# EAGLE design pololu-steppers-power-side (EAGLE 5.06)
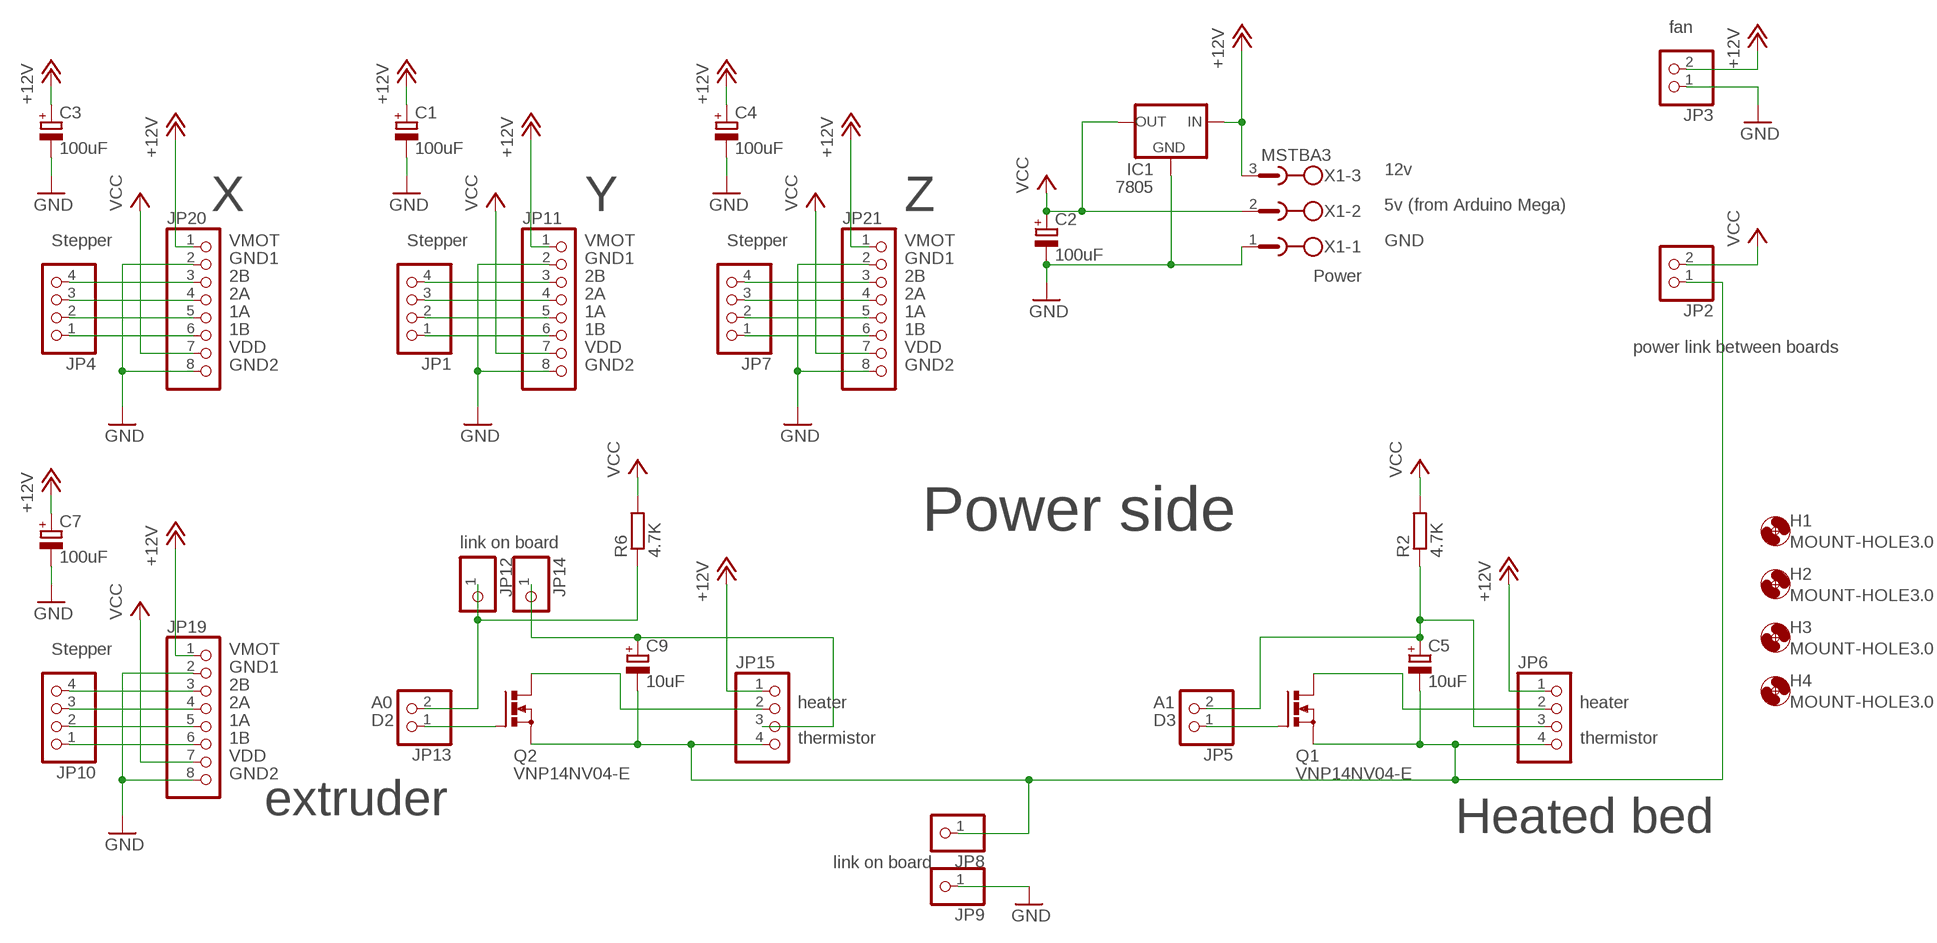
[diagram p0: schematic, sheet 1]

## Parts
C1  100uF  CPOL-EUE3.5-10  [E3,5-10]
C2  100uF  CPOL-EUE3.5-10  [E3,5-10]
C3  100uF  CPOL-EUE3.5-10  [E3,5-10]
C4  100uF  CPOL-EUE3.5-10  [E3,5-10]
C5  10uF  CPOL-EUE5-5  [E5-5]
C7  100uF  CPOL-EUE3.5-10  [E3,5-10]
C9  10uF  CPOL-EUE5-5  [E5-5]
H1  MOUNT-HOLE3.0  [3,0]
H2  MOUNT-HOLE3.0  [3,0]
H3  MOUNT-HOLE3.0  [3,0]
H4  MOUNT-HOLE3.0  [3,0]
IC1  7805  78XXS  [78XXS]
JP1  PINHD-1X4  [1X04]
JP2  PINHD-1X2  [1X02]
JP3  PINHD-1X2  [1X02]
JP4  PINHD-1X4  [1X04]
JP5  PINHD-1X2  [1X02]
JP6  PINHD-1X4  [1X04]
JP7  PINHD-1X4  [1X04]
JP8  PINHD-1X1  [1X01]
JP9  PINHD-1X1  [1X01]
JP10  PINHD-1X4  [1X04]
JP11  PINHD-1X8  [1X08]
JP12  PINHD-1X1  [1X01]
JP13  PINHD-1X2  [1X02]
JP14  PINHD-1X1  [1X01]
JP15  PINHD-1X4  [1X04]
JP19  PINHD-1X8  [1X08]
JP20  PINHD-1X8  [1X08]
JP21  PINHD-1X8  [1X08]
Q1  VNP14NV04-E  BUZ11BV  [TO220BV]
Q2  VNP14NV04-E  BUZ11BV  [TO220BV]
R2  4.7K  R-EU_0207/7  [0207/7]
R6  4.7K  R-EU_0207/7  [0207/7]
X1  MSTBA3  [MSTBA3]

## Nets
+12V: C1.+ C3.+ C4.+ C7.+ IC1.IN JP3.2 JP6.1 JP11.1 JP15.1 JP19.1 JP20.1 JP21.1 X1.3
GND: C1.- C2.- C3.- C4.- C7.- IC1.GND JP3.1 JP9.1 JP11.2 JP11.8 JP19.2 JP19.8 JP20.2 JP20.8 JP21.2 JP21.8 X1.1
N$1: JP6.2 Q1.D
N$2: JP12.1 JP13.2 R6.1
N$3: JP5.1 Q1.G
N$4: JP4.4 JP20.3
N$5: JP4.3 JP20.4
N$6: C5.+ JP5.2 JP6.3 R2.1
N$8: JP1.4 JP11.3
N$9: JP1.3 JP11.4
N$10: JP1.2 JP11.5
N$11: JP1.1 JP11.6
N$12: JP4.2 JP20.5
N$13: JP4.1 JP20.6
N$14: C5.- C9.- JP2.1 JP6.4 JP8.1 JP15.4 Q1.S Q2.S
N$23: JP7.4 JP21.3
N$24: JP7.3 JP21.4
N$25: JP7.2 JP21.5
N$26: JP7.1 JP21.6
N$33: JP10.4 JP19.3
N$34: JP10.3 JP19.4
N$35: JP10.2 JP19.5
N$36: JP10.1 JP19.6
N$41: JP13.1 Q2.G
N$42: JP15.2 Q2.D
N$44: C9.+ JP14.1 JP15.3
VCC: C2.+ IC1.OUT JP2.2 JP11.7 JP19.7 JP20.7 JP21.7 R2.2 R6.2 X1.2

## Notes on the sheet
- fan
- 12v
- X | Y | Z | 5v (from Arduino Mega)
- Stepper | VMOT | Stepper | VMOT | Stepper | VMOT | GND
- GND1 | GND1 | GND1
- 2B | 2B | 2B | Power
- 2A | 2A | 2A
- 1A | 1A | 1A
- 1B | 1B | 1B
- VDD | VDD | VDD | power link between boards
- GND2 | GND2 | GND2
- Power side
- link on board
- Stepper | VMOT
- GND1
- 2B
- 2A | A0 | heater | A1 | heater
- 1A | D2 | D3
- 1B | thermistor | thermistor
- VDD
- GND2
- extruder
- Heated bed
- link on board

## Library data of the parts
C1-C5 C7 C9 = rcl:CPOL-EU: POLARIZED CAPACITOR, European symbol
H1-H4 = holes:MOUNT-HOLE: MOUNTING HOLE with drill center marker
IC1 = v-reg:78XXS: VOLTAGE REGULATOR
JP1 JP4 JP6 JP7 JP10 JP15 = pinhead:PINHD-1X4: PIN HEADER
JP2 JP3 JP5 JP13 = pinhead:PINHD-1X2: PIN HEADER
JP8 JP9 JP12 JP14 = pinhead:PINHD-1X1: PIN HEADER
JP11 JP19-JP21 = pinhead:PINHD-1X8: PIN HEADER
Q1 Q2 = transistor-power:BUZ11: N-CHANNEL MOS FET
R2 R6 = rcl:R-EU_: RESISTOR, European symbol
X1 = con-phoenix-508:MSTBA3: PHOENIX

## Board
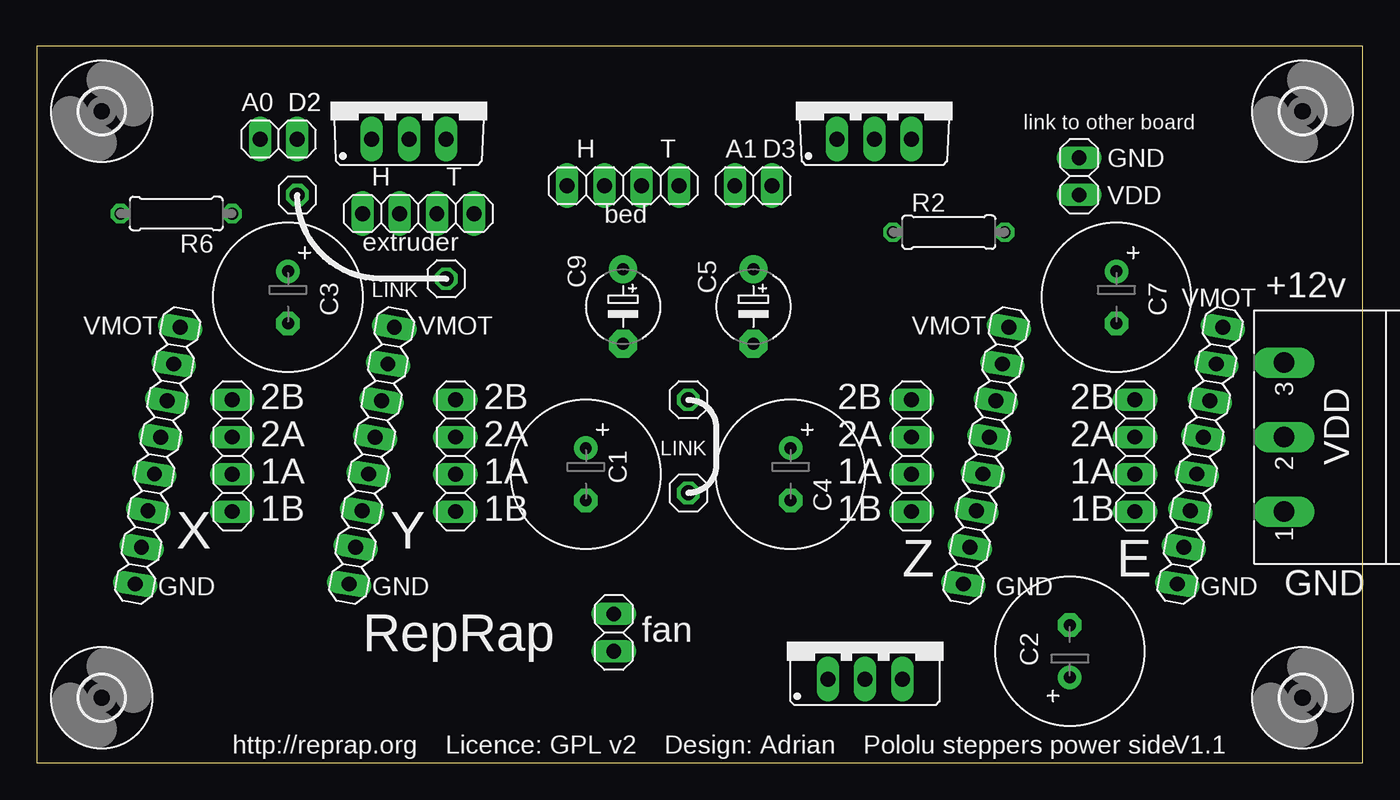
[diagram p1: board, top side]
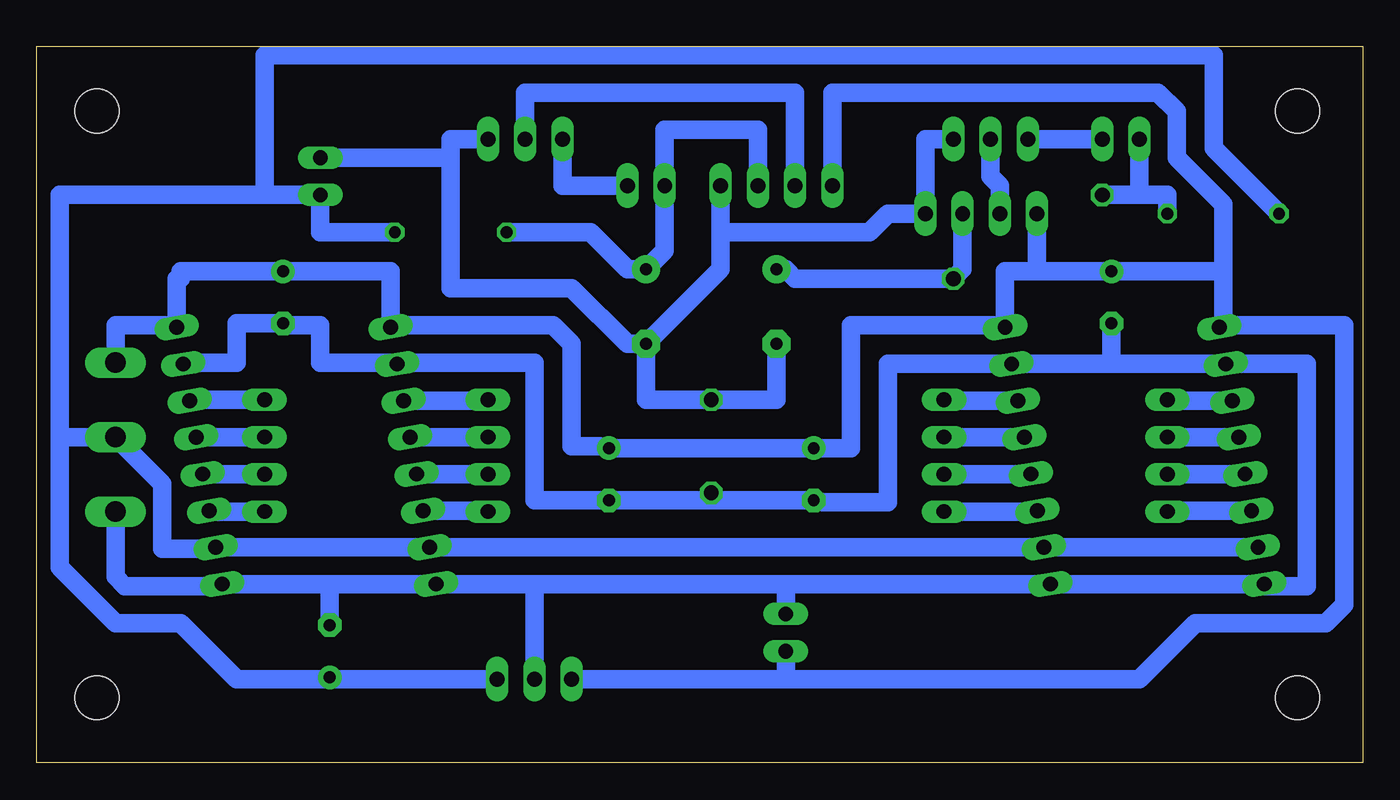
[diagram p2: board, bottom side, seen from below]

Size 90.47 x 48.88 mm. Coordinates in mm from the lower left corner, seen from the top.
Outline: 0,0 90.47,0 90.47,48.88 0,48.88 0,0
Copper layers (1*16): Top 0.035mm / dielectric 1.5mm / Bottom 0.035mm
Design rules "default": minimum track width 10mil, minimum drill 24mil, track to track 8mil, track to pad 8mil, pad to pad 8mil, via to via 8mil, smd to smd 8mil, copper to edge 40mil, drill to drill 8mil, minimum pad ring 10mil, minimum via ring 8mil, stop-mask expansion 4mil, vias tented up to drill 0mil, thermal gap 10mil

### Footprints (pad centres in the part's own frame; a part is rotated, then mirrored left to right if it is on the bottom)
E3,5-10 = drill 0.813 pad 1.6 round: + -1.778,0 | drill 0.813 pad 1.6 octagon: - 1.778,0
E5-5 = drill 0.813 pad 1.905 round: + -2.54,0 | drill 0.813 pad 1.905 octagon: - 2.54,0
3,0 = hole 3: 0,0
78XXS = drill 1.016 long: GND 0,-2.54; IN -2.54,-2.54; OUT 2.54,-2.54
1X04 = drill 1.016 long: 1 -3.81,0; 2 -1.27,0; 3 1.27,0; 4 3.81,0
1X02 = drill 1.016 long: 1 -1.27,0; 2 1.27,0
1X01 = drill 1.016 octagon: 1 0,0
1X08 = drill 1.016 long: 1 -8.89,0; 2 -6.35,0; 3 -3.81,0; 4 -1.27,0; 5 1.27,0; 6 3.81,0; 7 6.35,0; 8 8.89,0
TO220BV = drill 1.016 long: D 0,-2.54; G -2.54,-2.54; S 2.54,-2.54
0207/7 = drill 0.813 octagon: 1 -3.81,0; 2 3.81,0
MSTBA3 = drill 1.397 long: 1 -5.08,5.08; 2 0,5.08; 3 5.08,5.08

### Placement (x,y rotation side)
C1  37.47,19.68 270 top
C2  70.48,7.62 90 top
C3  17.14,31.75 270 top
C4  51.44,19.68 270 top
C5  48.9,31.11 270 top
C7  73.66,31.75 270 top
C9  40.01,31.11 270 top
H1  4.45,4.45 0 top
H2  86.36,4.45 0 top
H3  4.45,44.45 0 top
H4  86.36,44.45 0 top
IC1  56.52,8.26 0 top
JP1  28.57,20.95 90 top
JP2  71.12,40.01 270 top
JP3  39.37,8.89 270 top
JP4  13.34,20.95 90 top
JP5  48.9,39.37 180 top
JP6  40.01,39.37 0 top
JP7  59.69,20.95 90 top
JP8  44.45,24.77 0 top
JP9  44.45,18.41 0 top
JP10  74.93,20.95 90 top
JP11  22.86,20.95 260 top
JP12  17.78,38.73 0 top
JP13  16.51,42.55 180 top
JP14  27.94,33.02 0 top
JP15  26.04,37.47 0 top
JP19  79.38,20.95 260 top
JP20  8.26,20.95 260 top
JP21  64.77,20.95 260 top
Q1  57.15,45.09 0 top
Q2  25.4,45.09 0 top
R2  62.23,36.2 0 top
R6  9.53,37.47 180 top
X1  90.17,22.23 90 top

### Tracks (layer width: path | path; a pad name or v marks a point on that pad's centre or on a via)
+12V
  Bottom 1.27: 40.01,5.71 39.37,5.71 JP3.2 | 40.01,5.71 IC1.IN | 22.23,33.53 C3.+ 9.65,33.53 9.53,33.66 | 22.23,33.53 24.4,33.53 JP11.1 24.4,29.84 34.92,29.84 34.92,21.46 C1.+ C4.+ 52.07,21.59 53.98,21.59 53.98,28.57 55.24,29.84 66.18,29.84 JP21.1 66.31,33.53 C7.+ 80.64,33.53 80.64,33.02 80.92,33.02 JP19.1 81.05,29.84 85.09,29.84 X1.3 | 22.23,33.53 JP15.1 | 40.01,5.71 15.24,5.71 11.43,9.53 2.54,9.53 1.27,10.79 1.27,29.84 9.8,29.84 JP20.1 9.53,29.98 9.53,33.66 | JP6.1 36.2,45.72 13.97,45.72 12.7,44.45 12.7,41.27 9.53,38.1 9.53,33.66
GND
  Bottom 1.27: 39.37,12.2 JP11.8 JP20.8 6.71,12.06 3.81,12.06 3.81,27.21 JP20.2 17.14,27.21 | 39.37,12.2 56.52,12.2 | 56.52,12.2 JP21.8 70.48,12.2 | X1.1 85.09,12.7 84.45,12.06 77.97,12.06 JP19.8 70.48,12.2 | 17.14,27.21 JP11.2 32.38,27.21 32.38,17.78 36.83,17.78 C1.- 44.45,17.91 | 44.45,17.91 C4.- 56.52,17.91 56.52,27.3 65.87,27.3 | 65.87,27.3 JP21.2 | 65.87,27.3 71.12,27.3 71.12,29.84 73.66,29.84 C7.- 76.83,29.97 76.83,27.3 80.48,27.3 JP19.2 | 17.14,27.21 C3.- | 56.52,12.2 IC1.GND | 39.37,12.2 JP3.1 | 44.45,17.91 JP9.1 | 70.48,12.2 C2.-
N$1
  Bottom 1.27: Q1.D 57.15,45.72 38.73,45.72 JP6.2
N$2
  Bottom 1.27: 15.24,38.73 JP12.1 | 15.24,38.73 JP13.2 | 15.24,38.73 13.34,38.73 R6.1
N$3
  Bottom 1.27: Q1.G 54.61,39.37 JP5.1
N$4
  Bottom 1.27: JP20.3 13.28,24.71 JP4.4
N$5
  Bottom 1.27: JP20.4 13.32,22.21 JP4.3
N$6
  Bottom 1.27: JP6.3 41.27,43.18 47.62,43.18 JP5.2 47.62,34.92 C5.+ 50.16,33.66 52.7,36.2 R2.1
N$8
  Bottom 1.27: JP11.3 28.52,24.71 JP1.4
N$9
  Bottom 1.27: JP11.4 28.56,22.21 JP1.3
N$10
  Bottom 1.27: JP11.5 22.84,19.7 22.86,19.68 JP1.2
N$11
  Bottom 1.27: JP11.6 22.2,17.17 22.23,17.14 JP1.1
N$12
  Bottom 1.27: JP20.5 13.32,19.7 JP4.2
N$13
  Bottom 1.27: JP20.6 13.28,17.2 JP4.1
N$14
  Bottom 1.27: 71.75,41.27 JP2.1 62.23,41.27 | C9.- 40.01,24.77 JP8.1 48.9,24.77 C5.- | 62.23,41.27 62.23,32.38 53.98,32.38 50.16,28.57 C5.- | 43.81,36.2 43.81,33.66 C5.- | 43.81,36.2 JP6.4 | 43.81,36.2 33.66,36.2 32.38,37.47 JP15.4 29.84,42.55 Q2.S | Q1.S 62.23,42.55 62.23,41.27
N$23
  Bottom 1.27: JP21.3 59.75,24.71 JP7.4
N$24
  Bottom 1.27: JP21.4 59.71,22.21 JP7.3
N$25
  Bottom 1.27: JP21.5 59.71,19.7 JP7.2
N$26
  Bottom 1.27: JP21.6 59.75,17.2 JP7.1
N$33
  Bottom 1.27: JP10.4 79.98,24.77 JP19.3
N$34
  Bottom 1.27: JP10.3 79.58,22.23 JP19.4
N$35
  Bottom 1.27: JP10.2 79.14,19.68 JP19.5
N$36
  Bottom 1.27: JP10.1 78.66,17.14 JP19.6
N$41
  Bottom 1.27: JP13.1 Q2.G
N$42
  Bottom 1.27: 24.77,36.83 JP15.2 24.77,39.37 25.4,40.01 Q2.D
N$44
  Bottom 1.27: JP15.3 27.3,33.66 JP14.1 38.73,33.02 39.37,33.66 C9.+
VCC
  Bottom 1.27: JP20.7 JP11.7 JP21.7 | JP21.7 JP19.7 | IC1.OUT 70.48,5.71 C2.+ 70.61,5.71 76.83,5.71 80.64,9.53 85.09,9.53 88.9,13.34 88.9,21.59 | 88.9,21.59 88.9,22.23 X1.2 81.92,19.05 81.92,14.61 78.11,14.61 78.11,14.7 JP21.7 | 74.93,38.73 88.9,38.73 88.9,21.59 | 74.93,38.73 JP2.2 71.12,36.2 R2.2 | 74.93,38.73 74.93,48.26 10.16,48.26 10.16,41.91 R6.2

### Text on the board
tPlace: A0 | D2 | D2 | link to other board | H | T | A1 | D3 | GND | H | T | VDD | bed | extruder | LINK | +12v | VMOT | VMOT | VMOT | VMOT | 2B | 2B | 2B | 2B | 2A | 2A | 2A | 2A | LINK | VDD | 1A | 1A | 1A | 1A | 1B | 1B | 1B | 1B | X | Y | Z | E | GND | GND | GND | GND | GND | RepRap | http://reprap.org Licence: GPL v2 Design: Adrian Pololu steppers power side | V1.1
tNames: fan